# Altium schematic sheet Sheet1.SchDoc
size A; SheetNumber: 1; SheetTotal: 1
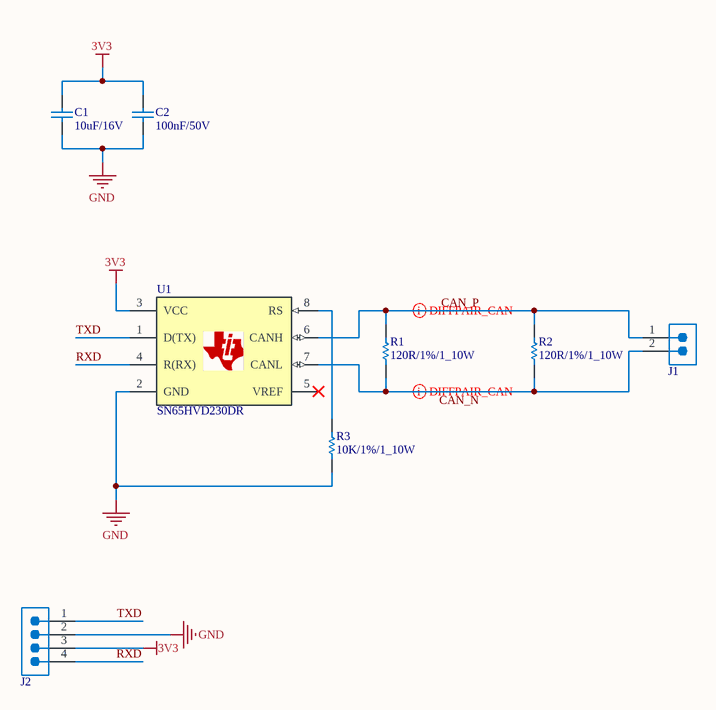
[diagram p0: Sheet1.SchDoc]

## Parts
C1  10uF/16V  [CAP_0603]
C2  100nF/50V  [CAP_0603]
J1  2.54mm_2P  [Header_2.54mm_2P]  (value not drawn)
J2  2.54mm_4P  [Header_2.54mm_4P]  (value not drawn)
R1  120R/1%/1_10W  [Resistor_0603]
R2  120R/1%/1_10W  [Resistor_0603]
R3  10K/1%/1_10W  [Resistor_0603]
U1  SN65HVD230DR  [SOIC-8]

## Nets
3V3: C1.2 C2.2 J2.3 U1.3(VCC)
GND: C1.1 C2.1 J2.2 R3.1 U1.2(GND)
CAN_N: J1.2 R1.1 R2.1 U1.7(CANL)
CAN_P: J1.1 R1.2 R2.2 U1.6(CANH)
RXD: J2.4 U1.4(R(RX))
TXD: J2.1 U1.1(D(TX))
NetR3_2: R3.2 U1.8(RS)

Not connected (* = marked no-connect by the designer): U1 5(VREF)*

## Layout directives
differential pair: CAN_N, CAN_P

## Library data of the parts
C1 = Ceramic_Cap_10uF_16V_0603: CAP, size 0603, 10uF, 16V; Supply Part Number: Tụ Gốm 0603 10uF 16V; Supply Name: Thegioiic; Datasheet: *; Supply URL: https://www.thegioiic.com/tu-gom-0603-10uf-16v
C2 = Ceramic_Cap_100nF_50V_0603: CAP, size 0603, 100nF, 50V; Supply Part Number: Tụ Gốm 0603 100nF (0.1uF) 50V; Supply Name: Thegioiic; Datasheet: *; Supply URL: https://www.thegioiic.com/tu-gom-0603-100nf-0-1uf-50v
J1 = Header_2.54mm_2P: Hàng Rào Đực Đơn 2.54mm 40 Chân 1 Hàng Cao 11.2mm Xuyên Lỗ; Supply Name: Thegioiic; Supply Part Number: Hàng Rào Đực Đơn 2.54mm 40 Chân 1 Hàng Cao 11.2mm Xuyên Lỗ; Supply URL: https://www.thegioiic.com/hang-rao-duc-don-2-54mm-40-chan-1-hang-cao-11-2mm-xuyen-lo
J2 = Header_2.54mm_4P: Hàng Rào Đực Đơn 2.54mm 40 Chân 1 Hàng Cao 11.2mm Xuyên Lỗ; Supply Name: Thegioiic; Supply Part Number: Hàng Rào Đực Đơn 2.54mm 40 Chân 1 Hàng Cao 11.2mm Xuyên Lỗ; Supply URL: https://www.thegioiic.com/hang-rao-duc-don-2-54mm-40-chan-1-hang-cao-11-2mm-xuyen-lo
R1 R2 = Res_120R_0603_1%: Resistor 0603 120 Ohm 1% 1_10W; Supply Part Number: Điện Trở 120 Ohm 0603 1%; Supply Name: Thegioiic; Supply URL: https://www.thegioiic.com/dien-tro-120-ohm-0603-1-
R3 = Res_10K_0603_1%: Resistor 0603 10KOhm 1% 1_10W; Supply Part Number: Điện Trở 10 KOhm 0603 1%; Supply Name: Thegioiic; Supply URL: https://www.thegioiic.com/dien-tro-10-kohm-0603-1-
U1 = SN65HVD230DR: 1/1 Transceiver Half CANbus; Supply Part Number: SN65HVD230DR CAN Transceiver 8-SOIC; Supply Name: Thegioiic; Datasheet: https://www.ti.com/lit/ds/symlink/sn65hvd230.pdf; Supply URL: https://www.thegioiic.com/sn65hvd230dr-can-transceiver-8-soic